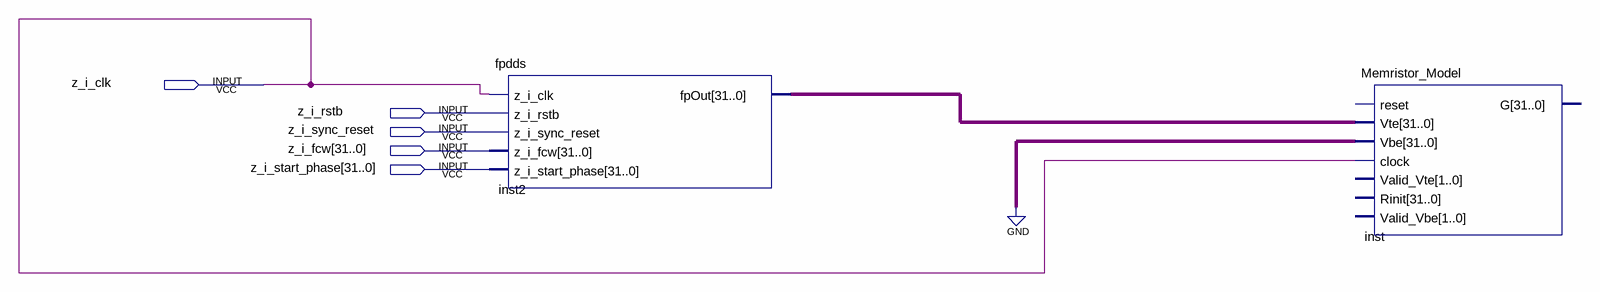
[diagram p0: schematic sheet]
// Quartus schematic MEMRIST.bdf as structural Verilog: 2 symbols, 5 pins
module MEMRIST (
  input  z_i_clk,
  input  z_i_rstb,
  input  z_i_sync_reset,
  input  [31:0] z_i_fcw,
  input  [31:0] z_i_start_phase
);

  wire [31:0] inst2_fpout;

  fpdds inst2 (
    .z_i_clk(z_i_clk), .z_i_rstb(z_i_rstb), .z_i_sync_reset(z_i_sync_reset), .z_i_fcw(z_i_fcw),
    .z_i_start_phase(z_i_start_phase), .fpOut(inst2_fpout));
  Memristor_Model inst (
    .Vte(inst2_fpout), .Vbe({32{1'b0}}), .clock(z_i_clk));  // open: reset, Valid_Vte, Rinit, Valid_Vbe, G
endmodule
